# EAGLE design SOIC14-TSSOP14 (EAGLE 7.2.0)
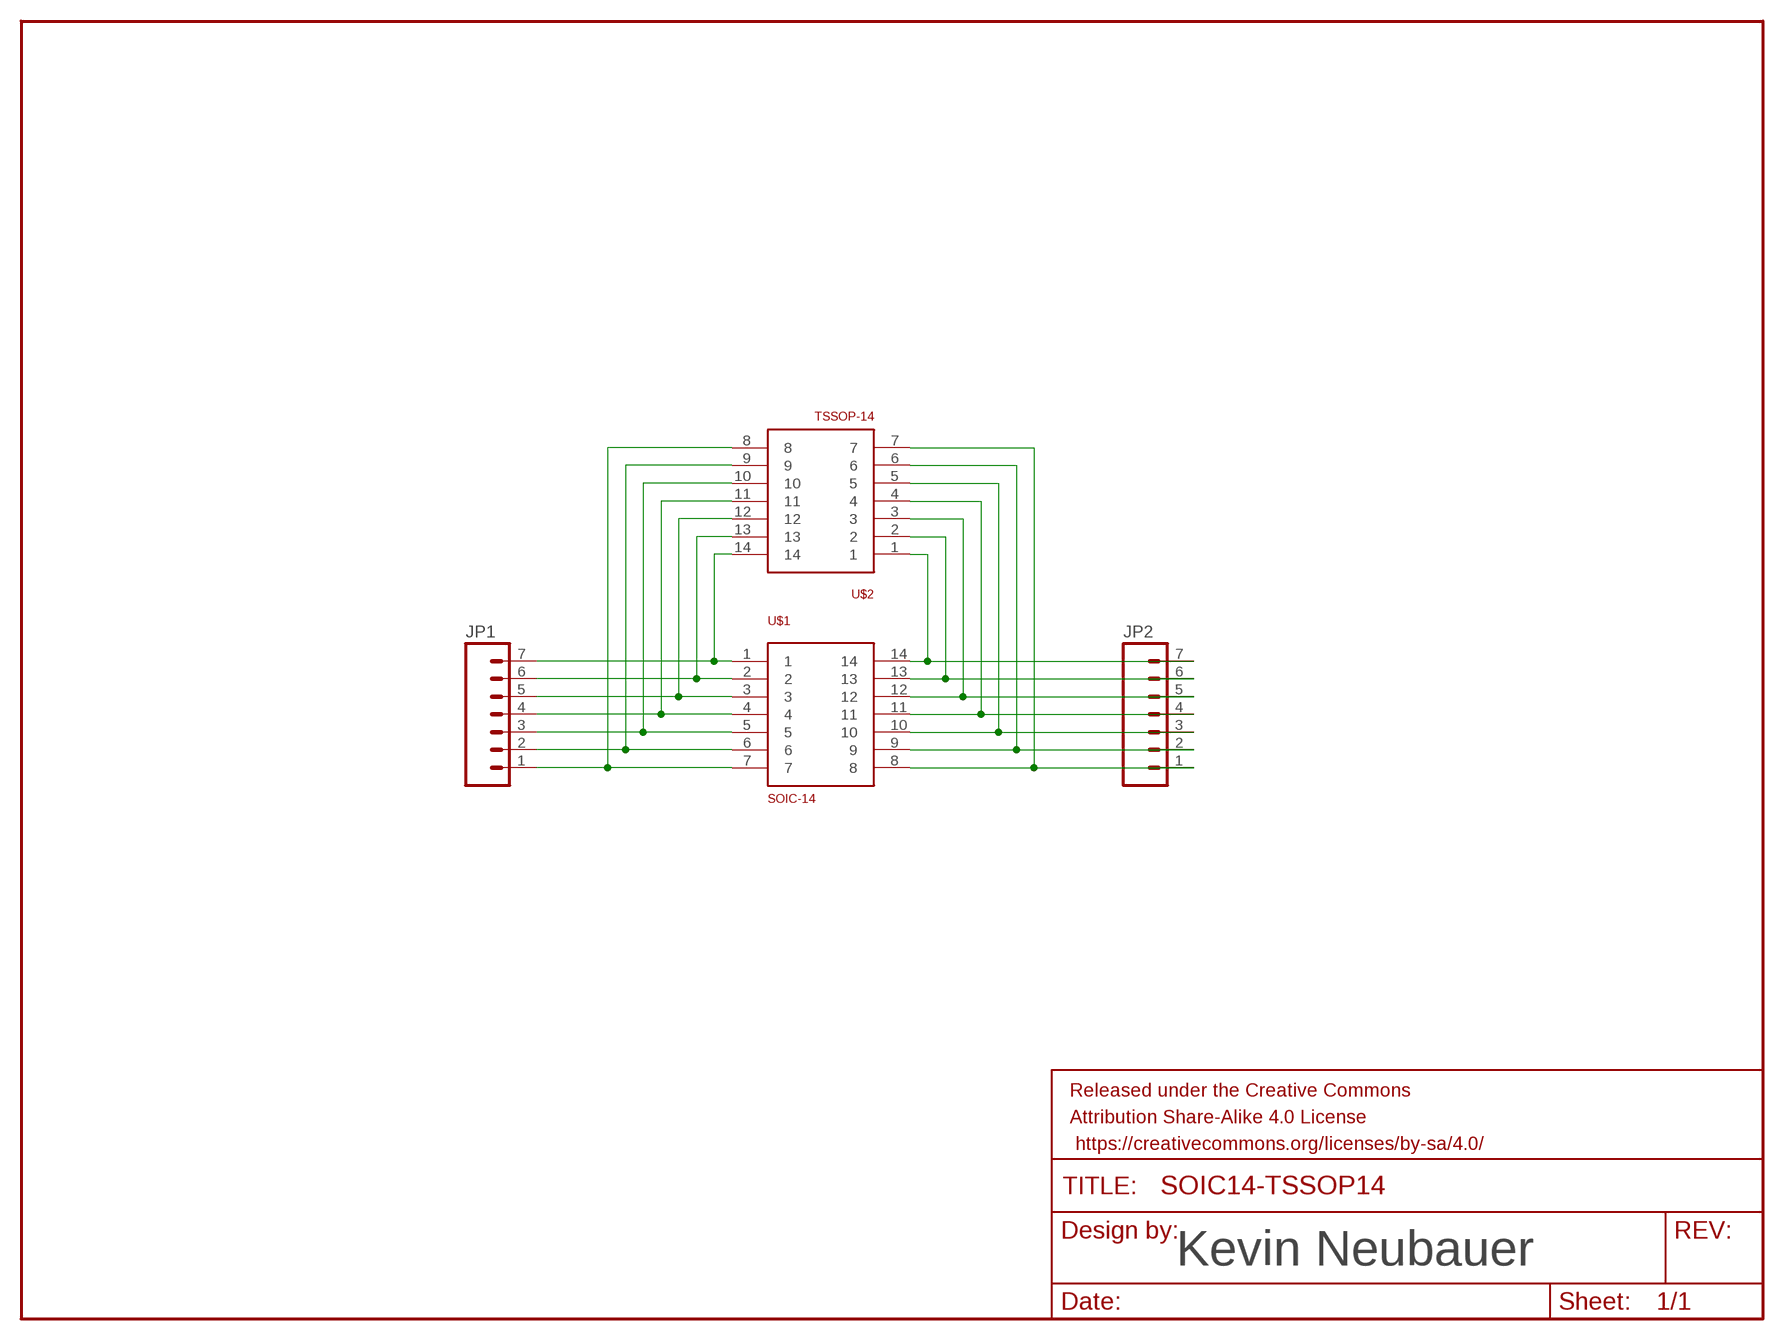
[diagram p0: schematic, sheet 1]

## Parts
FRAME1  FRAME-LETTER  [CREATIVE_COMMONS]
JP1  M07  [1X07]
JP2  M07  [1X07]
U$1  SOIC-14  [SOIC-14]
U$2  TSSOP-14  [TSSOP14]

## Nets
N$1: JP1.7 U$1.1 U$2.14
N$2: JP1.6 U$1.2 U$2.13
N$3: JP1.5 U$1.3 U$2.12
N$4: JP1.4 U$1.4 U$2.11
N$5: JP1.3 U$1.5 U$2.10
N$6: JP1.2 U$1.6 U$2.9
N$7: JP1.1 U$1.7 U$2.8
N$11: JP2.7 U$1.14 U$2.1
N$12: JP2.6 U$1.13 U$2.2
N$13: JP2.5 U$1.12 U$2.3
N$14: JP2.4 U$1.11 U$2.4
N$15: JP2.3 U$1.10 U$2.5
N$16: JP2.2 U$1.9 U$2.6
N$17: JP2.1 U$1.8 U$2.7

## Notes on the sheet
- Kevin Neubauer

## Library data of the parts
FRAME1 = SparkFun-Aesthetics:FRAME-LETTER: Schematic Frame Standard 8.5x11 US Letter frame
JP1 JP2 = SparkFun-Connectors:M07: Header 7 Standard 7-pin 0.1" header. Use with straight break away headers (SKU : PRT-00116), right angle break away headers (PRT-00553), swiss pins (PRT-00743), machine pins (PRT-00117), and female headers (PRT-00115). NOTES ON THE VARIANTS LOCK and LOCK_LONGPADS... This footprint was designed to help hold the alignment of a through-hole component (i.e. 7-pin header) while soldering it into place. You may notice that each hole has been shifted either up or down by 0.005 of an inch from it's more standard position (which is usually a perfectly straight line). This slight alteration caused the pins (the squares in the middle) to touch the edges of the holes. Because they are alternating, it causes a "brace" to hold the header in place. 0.005 has proven to be the perfect amount of "off-center" position when using our standard breakaway headers. Although looks a little odd when you look at the bare footprint, once you have a header in there, the alteration is very hard to notice. Also, if you push a header all the way into place, it is covered up entirely on the bottom side. This idea of altering the position of holes to aid alignment will be further integrated into the Sparkfun Library for other footprints. It can help hold any component with 3 or more connection pins.
U$1 = Kevin-GenericICFootprints:SOIC-14
U$2 = Kevin-GenericICFootprints:TSSOP-14

## Board
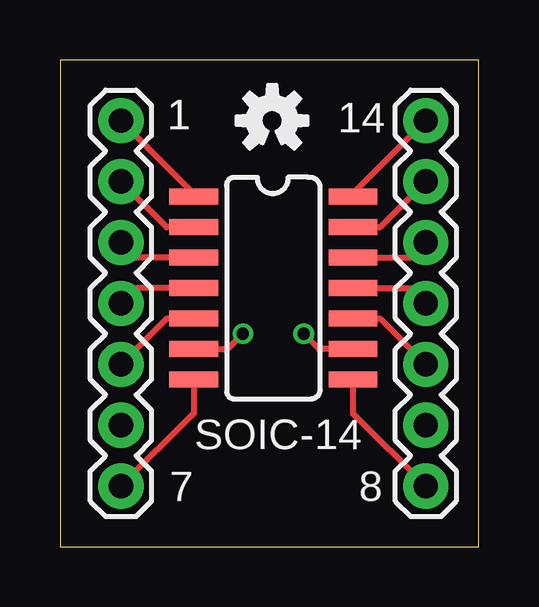
[diagram p1: board, top side]
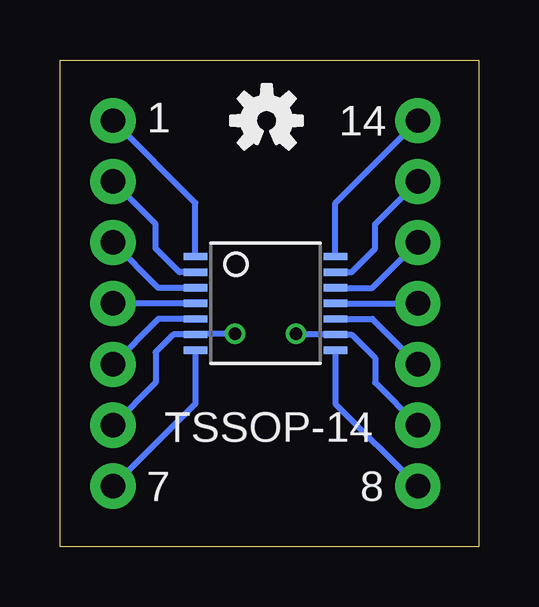
[diagram p2: board, bottom side, seen from below]

Size 17.45 x 20.31 mm. Coordinates in mm from the lower left corner, seen from the top.
Outline: 0,0 17.45,0 17.45,20.31 0,20.31 0,0
Copper layers (1*16): Top 0.0356mm / dielectric 1.5011mm / Bottom 0.0356mm
Design rules "OSH Park": minimum track width 6mil, minimum drill 13mil, track to track 6mil, track to pad 6mil, pad to pad 6mil, via to via 6mil, smd to smd 6mil, copper to edge 15mil, drill to drill 6mil, minimum pad ring 7mil, minimum via ring 7mil, stop-mask expansion 3mil, vias tented up to drill 0mil, thermal gap 10mil

### Footprints (pad centres in the part's own frame; a part is rotated, then mirrored left to right if it is on the bottom)
1X07 = drill 1.016 pad 1.88: 1 0,0; 2 2.54,0; 3 5.08,0; 4 7.62,0; 5 10.16,0; 6 12.7,0; 7 15.24,0
SOIC-14 = smd 0.66 x 2.032: 1 -4.445,-3.315; 2 -3.175,-3.315; 3 -1.905,-3.315; 4 -0.635,-3.315; 5 0.635,-3.315; 6 1.905,-3.315; 7 3.175,-3.315; 8 3.175,3.315; 9 1.905,3.315; 10 0.635,3.315; 11 -0.635,3.315; 12 -1.905,3.315; 13 -3.175,3.315; 14 -4.445,3.315
TSSOP14 = smd 0.305 x 0.991: 1 -1.95,-2.918; 2 -1.3,-2.918; 3 -0.65,-2.918; 4 0,-2.918; 5 0.65,-2.918; 6 1.3,-2.918; 7 1.95,-2.918; 8 1.95,2.918; 9 1.3,2.918; 10 0.65,2.918; 11 0,2.918; 12 -0.65,2.918; 13 -1.3,2.918; 14 -1.95,2.918

### Placement (x,y rotation side)
FRAME1  -10.92,-10.36 0 top  (outside the outline)
JP1  2.54,2.54 90 top
JP2  15.24,2.54 90 top
U$1  8.89,10.16 270 top
U$2  8.89,10.16 270 bottom
U$3  [OSHW-LOGO-S]  8.84,17.78 0 top
U$4  [OSHW-LOGO-S]  8.84,17.78 0 bottom

### Tracks (layer width: path | path; a pad name or v marks a point on that pad's centre or on a via)
N$1
  Top 0.254: U$1.1 5.57,14.74 JP1.7
  Bottom 0.254: U$2.14 5.97,14.35 JP1.7
N$2
  Top 0.254: U$1.2 4.45,13.33 JP1.6
  Bottom 0.254: U$2.13 5.3,11.46 4.32,12.45 4.32,13.46 JP1.6
N$3
  Top 0.254: U$1.3 3.18,12.06 JP1.5
  Bottom 0.254: U$2.12 4.43,10.81 JP1.5
N$4
  Top 0.254: U$1.4 3.18,10.79 JP1.4
  Bottom 0.254: U$2.11 JP1.4
N$5
  Top 0.254: U$1.5 4.45,9.52 JP1.3
  Bottom 0.254: U$2.10 4.43,9.51 JP1.3
N$6  (via drill 0.51)
  Top 0.254: U$1.6 6.99,8.25 v7.62,8.89
  Bottom 0.254: JP1.2 4.32,6.86 4.32,7.87 5.3,8.86 U$2.9 6,8.89 v7.62,8.89
N$7
  Top 0.254: U$1.7 5.57,5.58 JP1.1
  Bottom 0.254: U$2.8 5.97,5.97 JP1.1
N$11
  Top 0.254: U$1.14 12.21,14.74 JP2.7
  Bottom 0.254: U$2.1 11.81,14.35 JP2.7
N$12
  Top 0.254: U$1.13 13.34,13.33 JP2.6
  Bottom 0.254: U$2.2 12.48,11.46 13.46,12.45 13.46,13.46 JP2.6
N$13
  Top 0.254: U$1.12 14.61,12.06 JP2.5
  Bottom 0.254: U$2.3 13.35,10.81 JP2.5
N$14
  Top 0.254: U$1.11 14.61,10.79 JP2.4
  Bottom 0.254: U$2.4 JP2.4
N$15
  Top 0.254: U$1.10 13.34,9.52 JP2.3
  Bottom 0.254: U$2.5 13.35,9.51 JP2.3
N$16  (via drill 0.51)
  Top 0.254: U$1.9 10.79,8.25 v10.16,8.89
  Bottom 0.254: JP2.2 13.46,6.86 13.46,8.13 12.73,8.86 U$2.6 11.78,8.89 v10.16,8.89
N$17
  Top 0.254: U$1.8 12.21,5.58 JP2.1
  Bottom 0.254: U$2.7 11.81,5.97 JP2.1

### Text on the board
tPlace: 1 | 14 | SOIC-14 | 7 | 8
bPlace: 14 | 1 | TSSOP-14 | 8 | 7
tDocu: Kevin Neubauer